# EAGLE design shiftregisterbuttons (EAGLE 9.6.2)
Assembly variants: CS HIGH, CS LOW
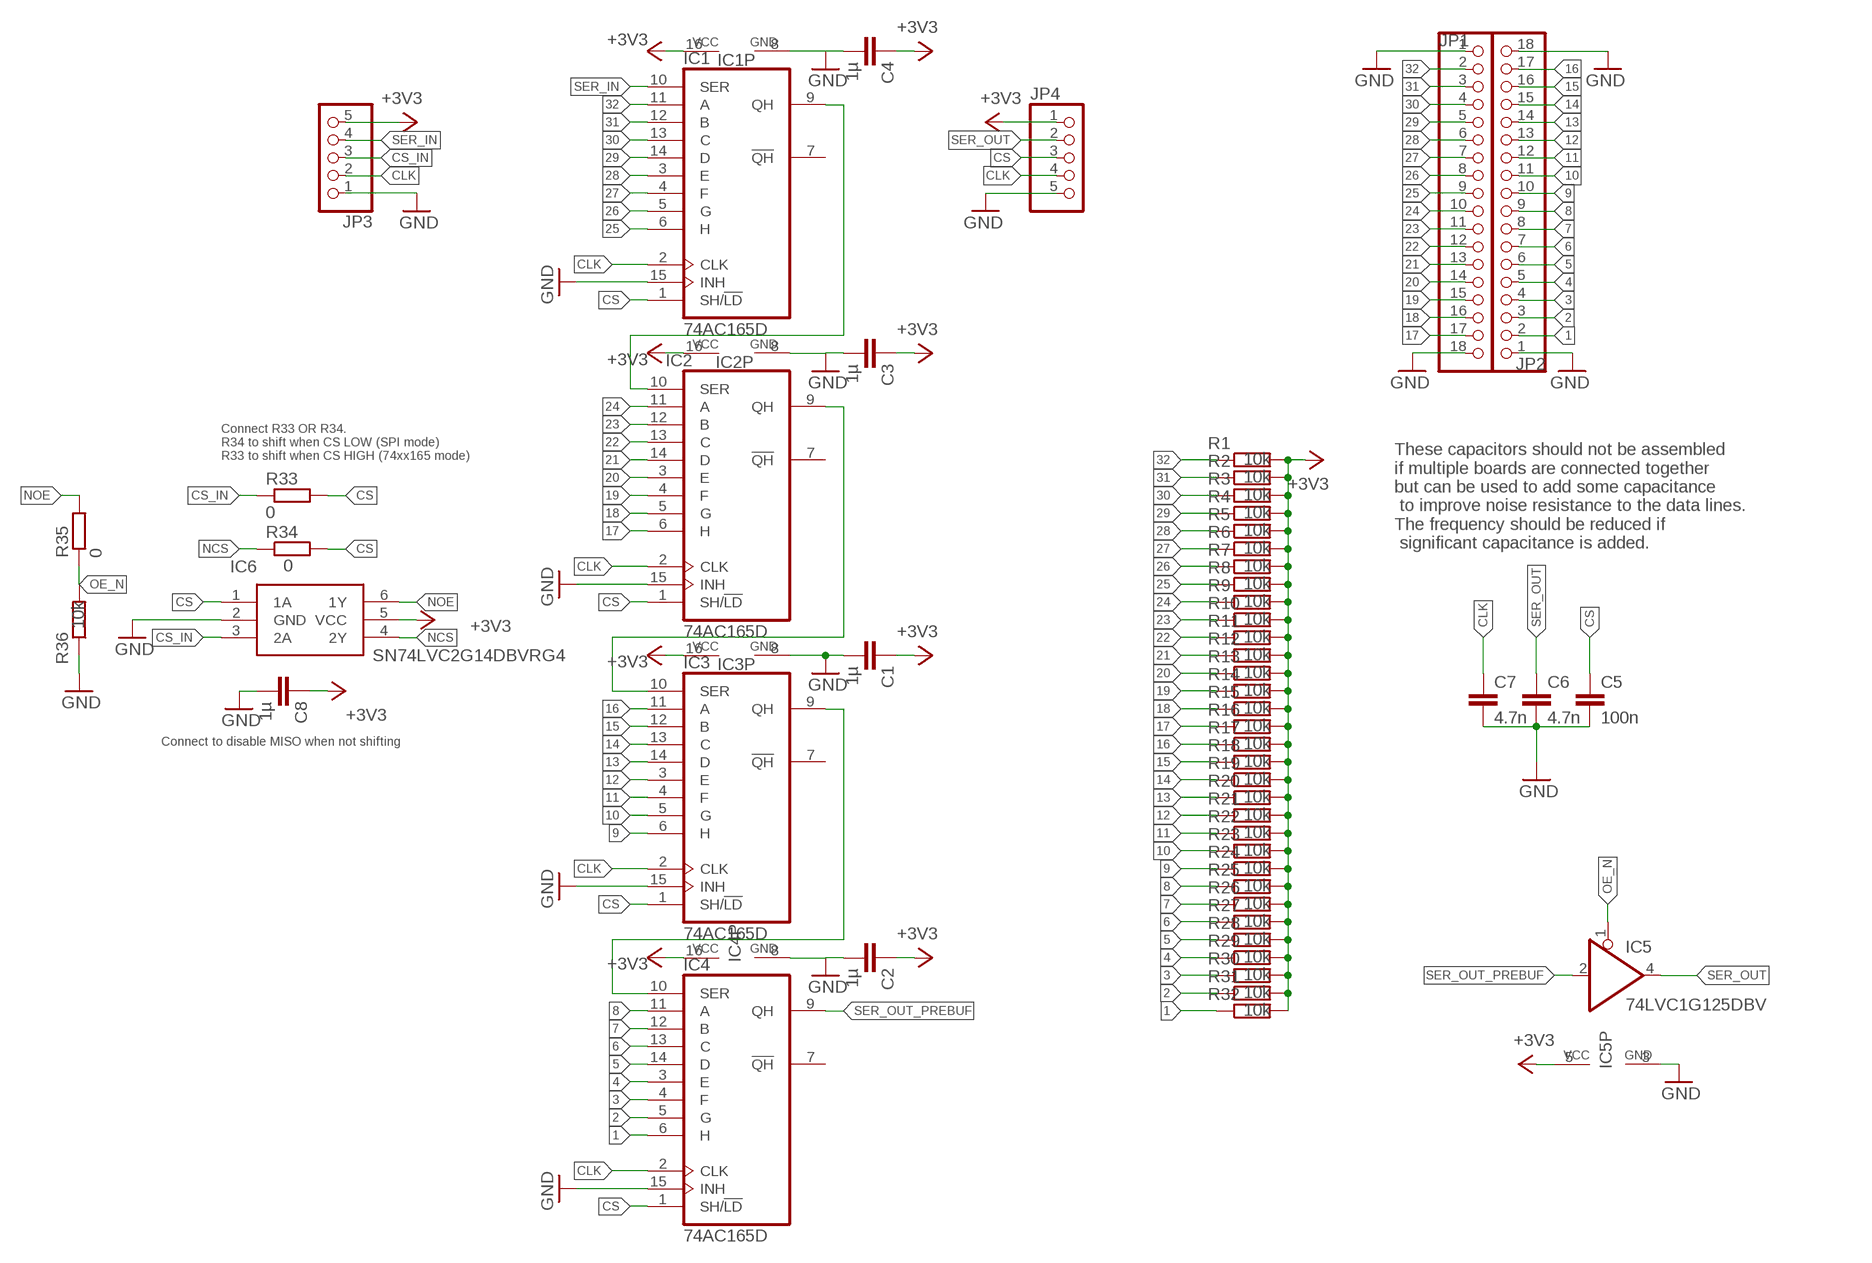
[diagram p0: schematic, sheet 1]

## Parts
C1  1µ  C-EUC0603  [C0603]
C2  1µ  C-EUC0603  [C0603]
C3  1µ  C-EUC0603  [C0603]
C4  1µ  C-EUC0603  [C0603]
C5  100n  C-EUC0603  [C0603]  (not fitted in variant CS HIGH)  (not fitted in variant CS LOW)
C6  4.7n  C-EUC0603  [C0603]  (not fitted in variant CS HIGH)  (not fitted in variant CS LOW)
C7  4.7n  C-EUC0603  [C0603]  (not fitted in variant CS HIGH)  (not fitted in variant CS LOW)
C8  1µ  C-EUC0603  [C0603]
IC1  74AC165D  [SO16]
IC2  74AC165D  [SO16]
IC3  74AC165D  [SO16]
IC4  74AC165D  [SO16]
IC5  74LVC1G125DBV  [SOT23-5]
IC6  SN74LVC2G14DBVRG4  [SOT95P280X145-6N]
JP1  PINHD-1X18  [1X18]
JP2  PINHD-1X18  [1X18]
JP3  PINHD-1X5  [1X05]
JP4  PINHD-1X5  [1X05]
R1  10k  R-EU_R0603  [R0603]
R2  10k  R-EU_R0603  [R0603]
R3  10k  R-EU_R0603  [R0603]
R4  10k  R-EU_R0603  [R0603]
R5  10k  R-EU_R0603  [R0603]
R6  10k  R-EU_R0603  [R0603]
R7  10k  R-EU_R0603  [R0603]
R8  10k  R-EU_R0603  [R0603]
R9  10k  R-EU_R0603  [R0603]
R10  10k  R-EU_R0603  [R0603]
R11  10k  R-EU_R0603  [R0603]
R12  10k  R-EU_R0603  [R0603]
R13  10k  R-EU_R0603  [R0603]
R14  10k  R-EU_R0603  [R0603]
R15  10k  R-EU_R0603  [R0603]
R16  10k  R-EU_R0603  [R0603]
R17  10k  R-EU_R0603  [R0603]
R18  10k  R-EU_R0603  [R0603]
R19  10k  R-EU_R0603  [R0603]
R20  10k  R-EU_R0603  [R0603]
R21  10k  R-EU_R0603  [R0603]
R22  10k  R-EU_R0603  [R0603]
R23  10k  R-EU_R0603  [R0603]
R24  10k  R-EU_R0603  [R0603]
R25  10k  R-EU_R0603  [R0603]
R26  10k  R-EU_R0603  [R0603]
R27  10k  R-EU_R0603  [R0603]
R28  10k  R-EU_R0603  [R0603]
R29  10k  R-EU_R0603  [R0603]
R30  10k  R-EU_R0603  [R0603]
R31  10k  R-EU_R0603  [R0603]
R32  10k  R-EU_R0603  [R0603]
R33  0  R-EU_R0603  [R0603]  (not fitted in variant CS LOW)
R34  0  R-EU_R0603  [R0603]  (not fitted in variant CS HIGH)
R35  0  R-EU_R0603  [R0603]
R36  10k  R-EU_R0603  [R0603]

## Nets
1: IC4.6(H) JP2.2 R32.1
2: IC4.5(G) JP2.3 R31.1
3: IC4.4(F) JP2.4 R30.1
4: IC4.3(E) JP2.5 R29.1
5: IC4.14(D) JP2.6 R28.1
6: IC4.13(C) JP2.7 R27.1
7: IC4.12(B) JP2.8 R26.1
8: IC4.11(A) JP2.9 R25.1
9: IC3.6(H) JP2.10 R24.1
10: IC3.5(G) JP2.11 R23.1
11: IC3.4(F) JP2.12 R22.1
12: IC3.3(E) JP2.13 R21.1
13: IC3.14(D) JP2.14 R20.1
14: IC3.13(C) JP2.15 R19.1
15: IC3.12(B) JP2.16 R18.1
16: IC3.11(A) JP2.17 R17.1
17: IC2.6(H) JP1.17 R16.1
18: IC2.5(G) JP1.16 R15.1
19: IC2.4(F) JP1.15 R14.1
20: IC2.3(E) JP1.14 R13.1
21: IC2.14(D) JP1.13 R12.1
22: IC2.13(C) JP1.12 R11.1
23: IC2.12(B) JP1.11 R10.1
24: IC2.11(A) JP1.10 R9.1
25: IC1.6(H) JP1.9 R8.1
26: IC1.5(G) JP1.8 R7.1
27: IC1.4(F) JP1.7 R6.1
28: IC1.3(E) JP1.6 R5.1
29: IC1.14(D) JP1.5 R4.1
30: IC1.13(C) JP1.4 R3.1
31: IC1.12(B) JP1.3 R2.1
32: IC1.11(A) JP1.2 R1.1
+3V3: C1.1 C2.1 C3.1 C4.1 C8.1 IC1.16(VCC) IC2.16(VCC) IC3.16(VCC) IC4.16(VCC) IC5.5(VCC) IC6.5(VCC) JP3.5 JP4.1 R1.2 R2.2 R3.2 R4.2 R5.2 R6.2 R7.2 R8.2 R9.2 R10.2 R11.2 R12.2 R13.2 R14.2 R15.2 R16.2 R17.2 R18.2 R19.2 R20.2 R21.2 R22.2 R23.2 R24.2 R25.2 R26.2 R27.2 R28.2 R29.2 R30.2 R31.2 R32.2
CLK: C7.1 IC1.2(CLK) IC2.2(CLK) IC3.2(CLK) IC4.2(CLK) JP3.2 JP4.4
CS: C5.1 IC1.1(SH/!LD) IC2.1(SH/!LD) IC3.1(SH/!LD) IC4.1(SH/!LD) IC6.1(1A) JP4.3 R33.2 R34.2
CS_IN: IC6.3(2A) JP3.3 R33.1
GND: C1.2 C2.2 C3.2 C4.2 C5.2 C6.2 C7.2 C8.2 IC1.8(GND) IC1.15(INH) IC2.8(GND) IC2.15(INH) IC3.8(GND) IC3.15(INH) IC4.8(GND) IC4.15(INH) IC5.3(GND) IC6.2(GND) JP1.1 JP1.18 JP2.1 JP2.18 JP3.1 JP4.5 R36.1
N$1: IC2.9(QH) IC3.10(SER)
N$2: IC3.9(QH) IC4.10(SER)
NCS: IC6.4(2Y) R34.1
NOE: IC6.6(1Y) R35.2
OE_N: IC5.1(OE) R35.1 R36.2
SER1: IC1.9(QH) IC2.10(SER)
SER_IN: IC1.10(SER) JP3.4
SER_OUT: C6.1 IC5.4(O) JP4.2
SER_OUT_PREBUF: IC4.9(QH) IC5.2(I)
Unconnected: IC1.7(!QH) IC2.7(!QH) IC3.7(!QH) IC4.7(!QH)

## Notes on the sheet
- Connect R33 OR R34.
  R34 to shift when CS LOW (SPI mode)
  R33 to shift when CS HIGH (74xx165 mode)
- These capacitors should not be assembled 
  if multiple boards are connected together 
  but can be used to add some capacitance
   to improve noise resistance to the data lines.
  The frequency should be reduced if
   significant capacitance is added.
- Connect to disable MISO when not shifting

## Library data of the parts
C1-C8 = resistor:C-EU: CAPACITOR, European symbol
IC1-IC4 = 74xx-eu:74*165: 8-bit parallel load SHIFT REGISTER
IC5 = 74xx-little-de:74*1G125: Single Bus Buffer Gate with 3-State Output
IC6 = SamacSys_Parts:SN74LVC2G14DBVRG4: Dual Schmitt-Trigger Inverter Source: Datasheet <http://www.ti.com/lit/gpn/SN74LVC2G14>; ARROW_PART_NUMBER: SN74LVC2G14DBVRG4; ARROW_PRICE-STOCK: https://www.arrow.com/en/products/sn74lvc2g14dbvrg4/texas-instruments?utm_currency=USD&region=nac; DESCRIPTION: Dual Schmitt-Trigger Inverter; HEIGHT: 1.45mm; MANUFACTURER_NAME: Texas Instruments; MANUFACTURER_PART_NUMBER: SN74LVC2G14DBVRG4; MOUSER_PART_NUMBER: 595-SN74LVC2G14DBVG4; MOUSER_PRICE-STOCK: https://www.mouser.co.uk/ProductDetail/Texas-Instruments/SN74LVC2G14DBVRG4?qs=pajgIaoyDUjLahZkznp%2F9Q%3D%3D
JP1 JP2 = pinhead:PINHD-1X18: PIN HEADER
JP3 JP4 = pinhead:PINHD-1X5: PIN HEADER
R1-R36 = resistor:R-EU_: RESISTOR, European symbol

## Board
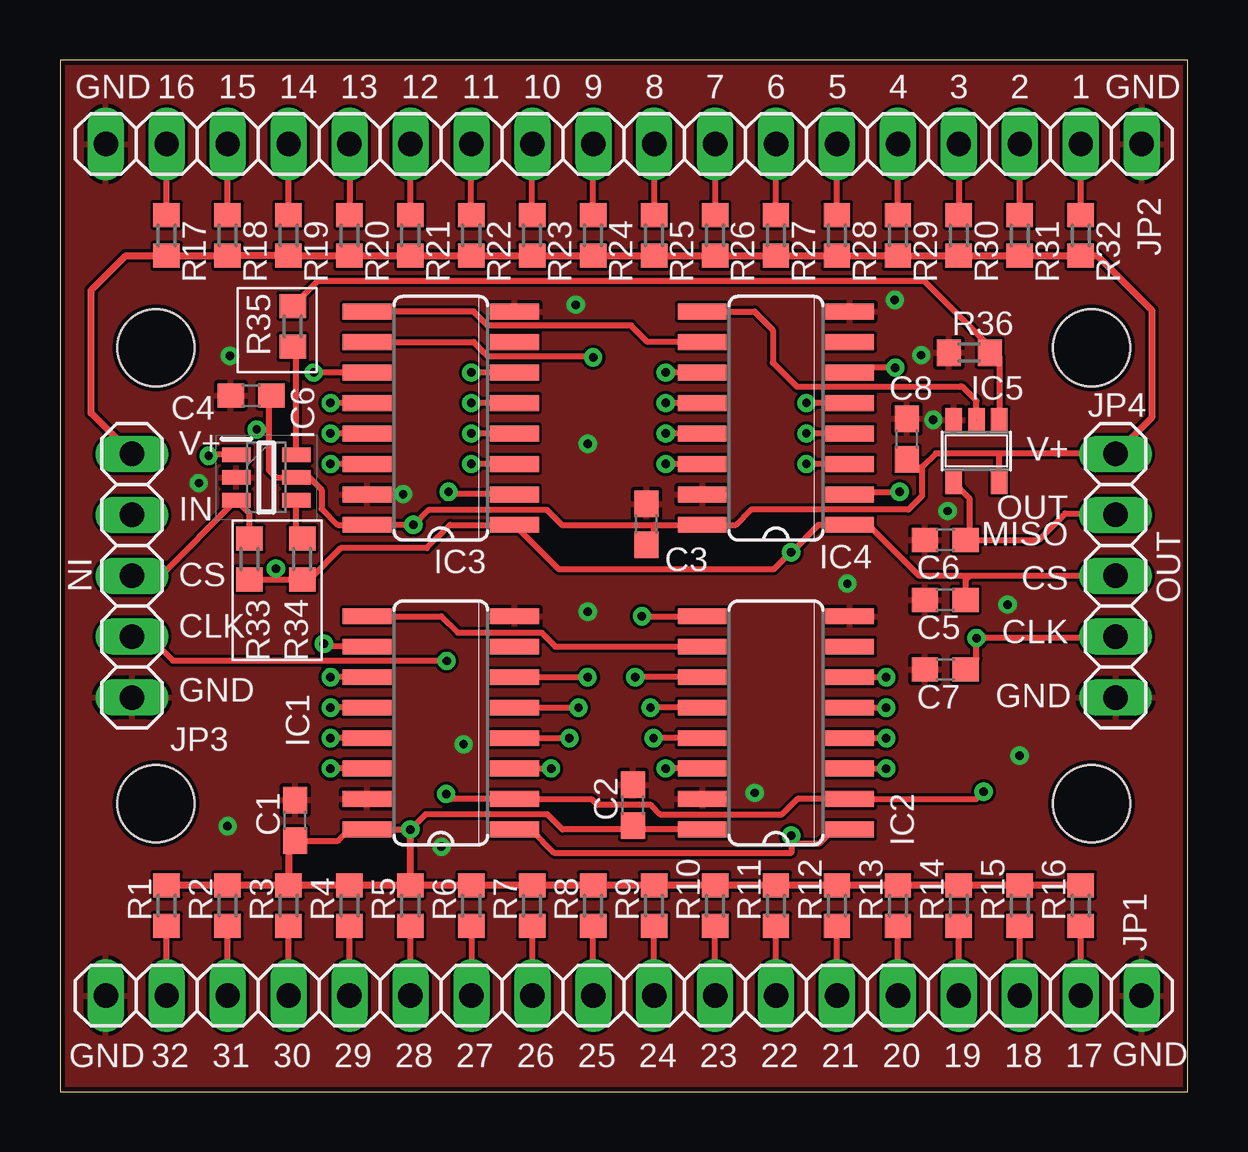
[diagram p1: board, top side]
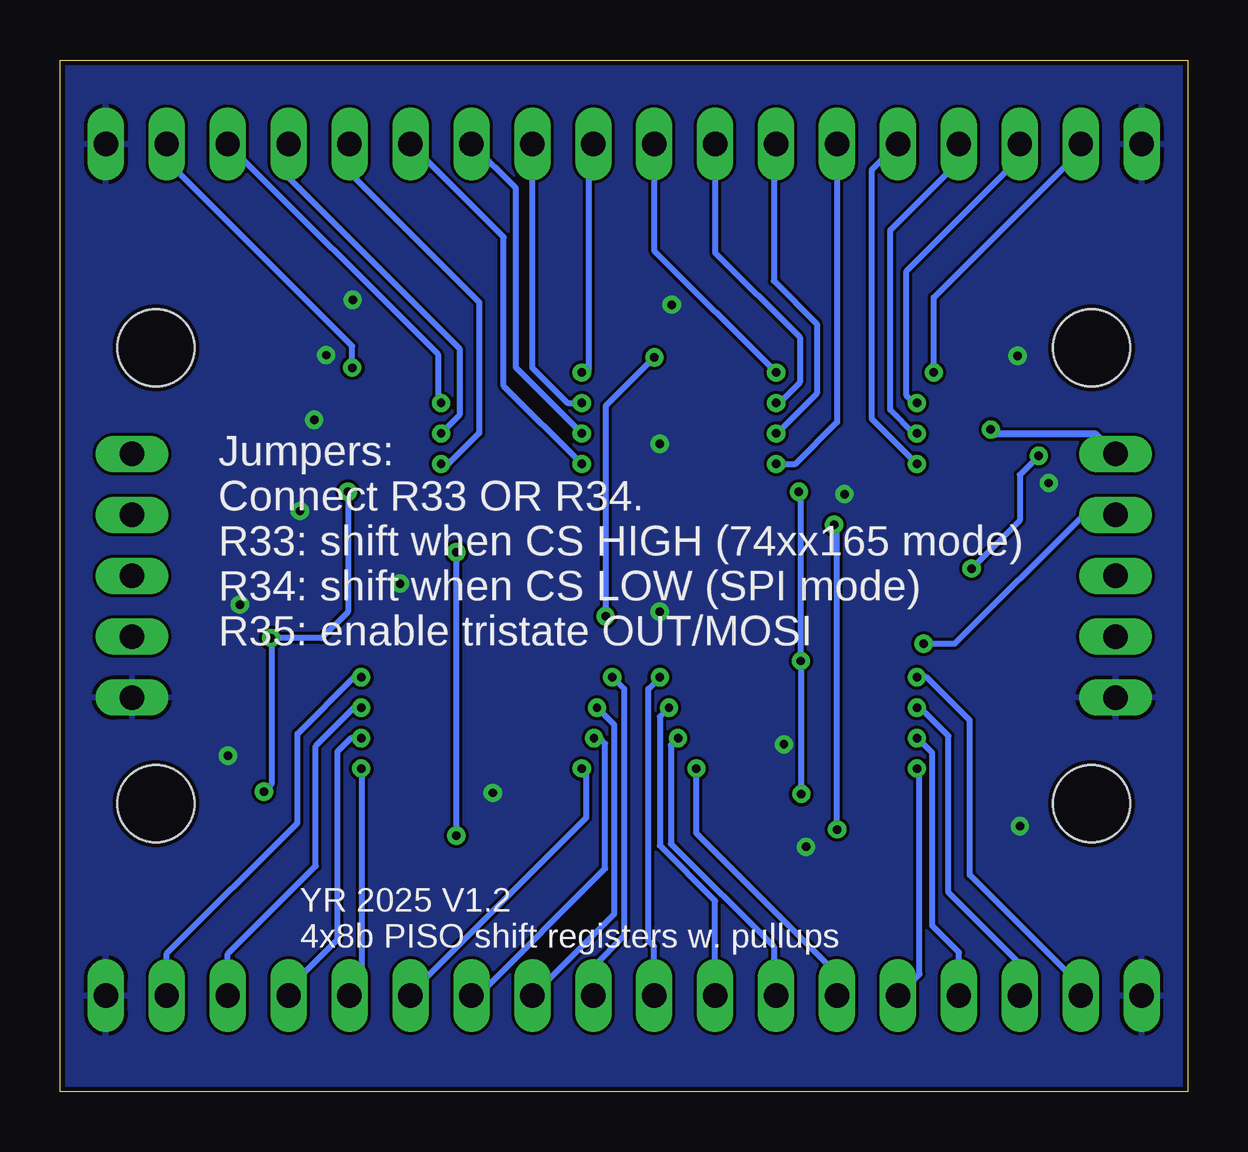
[diagram p2: board, bottom side, seen from below]

Size 47 x 43 mm. Coordinates in mm from the lower left corner, seen from the top.
Outline: 0,43 0,0 47,0 47,43 0,43
Copper layers (1*16): Top 0.035mm / dielectric 1.5mm / Bottom 0.035mm
Design rules "jlcpcb *": minimum track width 5mil, minimum drill 0.3mm, track to track 5mil, track to pad 5mil, pad to pad 5mil, via to via 5mil, smd to smd 5mil, copper to edge 0.2mm, drill to drill 8mil, minimum pad ring 10mil, minimum via ring 8mil, stop-mask expansion 4mil, vias tented up to drill 4mm, thermal gap 6mil
Holes 3.2 mm at 4,31 4,12 43,12 43,31

### Footprints (pad centres in the part's own frame; a part is rotated, then mirrored left to right if it is on the bottom)
C0603 = smd 1.1 x 1: 1 -0.85,0; 2 0.85,0
SO16 = smd 0.66 x 2.032: 1 -4.445,-3.073; 2 -3.175,-3.073; 3 -1.905,-3.073; 4 -0.635,-3.073; 5 0.635,-3.073; 6 1.905,-3.073; 7 3.175,-3.073; 8 4.445,-3.073; 9 4.445,3.073; 10 3.175,3.073; 11 1.905,3.073; 12 0.635,3.073; 13 -0.635,3.073; 14 -1.905,3.073; 15 -3.175,3.073; 16 -4.445,3.073
SOT23-5 = smd 0.69 x 0.99: 1 -0.95,-1.29; 2 0,-1.29; 3 0.95,-1.29; 4 0.95,1.3; 5 -0.95,1.3
SOT95P280X145-6N = smd 1.2 x 0.6: 1 -1.25,0.95; 2 -1.25,0; 3 -1.25,-0.95; 4 1.25,-0.95; 5 1.25,0; 6 1.25,0.95
1X18 = drill 1.016 long: 1 -21.59,0; 2 -19.05,0; 3 -16.51,0; 4 -13.97,0; 5 -11.43,0; 6 -8.89,0; 7 -6.35,0; 8 -3.81,0; 9 -1.27,0; 10 1.27,0; 11 3.81,0; 12 6.35,0; 13 8.89,0; 14 11.43,0; 15 13.97,0; 16 16.51,0; 17 19.05,0; 18 21.59,0
1X05 = drill 1.016 long: 1 -5.08,0; 2 -2.54,0; 3 0,0; 4 2.54,0; 5 5.08,0
R0603 = smd 1 x 1.1: 1 -0.85,0; 2 0.85,0

### Placement (x,y rotation side)
C1  9.79,11.3 90 top
C2  23.88,11.94 90 top
C3  24.44,23.65 90 top
C4  7.97,29.01 180 top
C5  36.9,20.5 180 top  (not fitted)
C6  36.9,23 180 top  (not fitted)
C7  36.9,17.6 180 top  (not fitted)
C8  35.3,27.2 90 top
IC1  15.88,15.37 90 top
IC2  29.84,15.37 90 top
IC3  15.88,28.07 90 top
IC4  29.84,28.07 90 top
IC5  38.2,26.7 180 top
IC6  8.6,25.6 0 top
JP1  23.5,4 0 top
JP2  23.5,39.5 180 top
JP3  3,21.5 90 top
JP4  44,21.5 270 top
R1  4.45,7.75 90 top
R2  6.99,7.75 90 top
R3  9.53,7.75 90 top
R4  12.06,7.75 90 top
R5  14.61,7.75 90 top
R6  17.14,7.75 90 top
R7  19.68,7.75 90 top
R8  22.23,7.75 90 top
R9  24.77,7.75 90 top
R10  27.3,7.75 90 top
R11  29.84,7.75 90 top
R12  32.38,7.75 90 top
R13  34.92,7.75 90 top
R14  37.47,7.75 90 top
R15  40.01,7.75 90 top
R16  42.55,7.75 90 top
R17  4.45,35.69 270 top
R18  6.99,35.69 270 top
R19  9.53,35.69 270 top
R20  12.06,35.69 270 top
R21  14.61,35.69 270 top
R22  17.14,35.69 270 top
R23  19.68,35.69 270 top
R24  22.23,35.69 270 top
R25  24.77,35.69 270 top
R26  27.3,35.69 270 top
R27  29.84,35.69 270 top
R28  32.38,35.69 270 top
R29  34.92,35.69 270 top
R30  37.47,35.69 270 top
R31  40.01,35.69 270 top
R32  42.55,35.69 270 top
R33  7.9,22.2 270 top
R34  10.1,22.2 270 top  (not fitted)
R35  9.7,31.9 270 top
R36  37.9,30.8 0 top

### Tracks (layer width: path | path; a pad name or v marks a point on that pad's centre or on a via)
1  (via drill 0.35)
  Top 0.254: IC4.6 33.12,30.17 v34.82,30.17 | R32.1 42.37,36.72 42.55,36.9 JP2.2
  Bottom 0.254: v34.82,30.17 34.82,31.07 42.55,38.8 JP2.2
2  (via drill 0.35)
  Top 0.254: IC4.5 v31.11,28.7 | R31.1 40.09,36.62 40.01,36.7 JP2.3
  Bottom 0.254: JP2.3 31.24,30.73 31.24,28.83 v31.11,28.7
3  (via drill 0.35)
  Top 0.254: IC4.4 v31.11,27.43 | JP2.4 R30.1
  Bottom 0.254: JP2.4 37.47,38.1 30.34,30.98 30.34,28.2 v31.11,27.43
4  (via drill 0.35)
  Top 0.254: IC4.3 v31.11,26.16 | R29.1 34.9,36.57 34.93,36.6 JP2.5
  Bottom 0.254: JP2.5 34.93,38.3 29.53,32.9 29.53,27.45 30.82,26.16 v31.11,26.16
5  (via drill 0.35)
  Top 0.254: IC4.14 v25.25,26.16 | R28.1 32.38,36.41 32.39,36.4 JP2.6
  Bottom 0.254: v25.25,26.16 28.5,29.42 28.5,35.61 JP2.6
6  (via drill 0.35)
  Top 0.254: IC4.13 v25.25,27.43 | R27.1 29.84,39.34 29.93,39.42 JP2.7
  Bottom 0.254: v25.25,27.43 27.99,30.18 27.99,37.65 JP2.7 | JP2.7
7  (via drill 0.35)
  Top 0.254: IC4.12 v25.25,28.7 | JP2.8 27.31,36.9 27.13,36.72 R26.1
  Bottom 0.254: JP2.8 27.31,30.16 25.85,28.7 v25.25,28.7
8  (via drill 0.35)
  Top 0.254: IC4.11 v25.25,29.97 | JP2.9 24.77,36.8 24.64,36.67 R25.1
  Bottom 0.254: JP2.9 24.97,39.3 24.97,29.97 v25.25,29.97
9  (via drill 0.35)
  Top 0.254: IC3.6 v17.14,29.97 | R24.1 JP2.10
  Bottom 0.254: JP2.10 22.23,35.06 v17.14,29.97
10  (via drill 0.35)
  Top 0.254: JP2.11 19.64,39.45 19.68,39.4 R23.1 | IC3.5 v17.14,28.7
  Bottom 0.254: JP2.11 19.69,34.97 16.16,31.44 16.16,29.56 17.01,28.7 v17.14,28.7
11  (via drill 0.35)
  Top 0.254: IC3.4 v17.14,27.43 | R22.1 JP2.12
  Bottom 0.254: JP2.12 17.25,39.4 17.25,33.8 15.45,32 15.45,29.1 17.12,27.43 v17.14,27.43
12  (via drill 0.35)
  Top 0.254: IC3.3 v17.14,26.16 | R21.1 JP2.13
  Bottom 0.254: v17.14,26.16 16.34,26.16 14.61,27.9 JP2.13
13  (via drill 0.35)
  Top 0.254: IC3.14 v11.28,26.16 | JP2.14 R20.1
  Bottom 0.254: v11.28,26.16 13.17,28.06 13.17,38.4 JP2.14
14  (via drill 0.35)
  Top 0.254: IC3.13 v11.28,27.43 | R19.1 JP2.15
  Bottom 0.254: v11.28,27.43 11.4,27.43 12.39,28.42 12.39,35.9 9.53,38.76 JP2.15
15  (via drill 0.35)
  Top 0.254: JP2.16 | IC3.12 v11.28,28.7 | R18.1 JP2.16
  Bottom 0.254: v11.28,28.7 11.4,28.7 11.71,29.01 11.71,34.2 7.09,38.82 7.09,39.5 JP2.16
16  (via drill 0.35)
  Top 0.254: JP2.17 R17.1 | IC3.11 v10.58,29.97
  Bottom 0.254: v10.58,29.97 10.58,33.1 4.45,39.23 JP2.17
17  (via drill 0.35)
  Top 0.254: IC2.6 v34.44,17.27 | JP1.17 R16.1
  Bottom 0.254: JP1.17 42.55,5.75 37.1,11.2 37.1,14.91 34.74,17.27 v34.44,17.27
18  (via drill 0.35)
  Top 0.254: IC2.5 v34.44,16 | JP1.16 R15.1
  Bottom 0.254: JP1.16 40.01,5.73 36.34,9.4 36.34,14.4 34.74,16 v34.44,16
19  (via drill 0.35)
  Top 0.254: IC2.4 v34.44,14.73 | JP1.15 R14.1
  Bottom 0.254: v34.44,14.73 34.87,14.73 35.43,14.17 35.43,6.34 37.47,4.3 JP1.15
20  (via drill 0.35)
  Top 0.254: IC2.3 v34.44,13.46 | JP1.14 R13.1
  Bottom 0.254: JP1.14 34.42,4 34.42,13.44 v34.44,13.46
21  (via drill 0.35)
  Top 0.254: IC2.14 v25.25,13.46 | JP1.13 R12.1
  Bottom 0.254: v25.25,13.46 25.07,13.28 25.07,11.41 32.39,4.09 JP1.13
22  (via drill 0.35)
  Top 0.254: IC2.13 v24.74,14.73 | JP1.12 R11.1
  Bottom 0.254: JP1.12 29.58,4 24.28,9.3 24.28,14.5 24.51,14.73 v24.74,14.73
23  (via drill 0.35)
  Top 0.254: IC2.12 v24.61,16 | JP1.11 R10.1
  Bottom 0.254: v24.61,16 23.89,15.28 23.89,7.42 JP1.11
24  (via drill 0.35)
  Top 0.254: IC2.11 v23.98,17.27 | JP1.10 R9.1
  Bottom 0.254: JP1.10 24.77,5.2 23.49,6.48 23.49,16.78 v23.98,17.27
25  (via drill 0.35)
  Top 0.254: IC1.6 v22,17.27 | JP1.9 R8.1
  Bottom 0.254: v22,17.27 22.48,16.79 22.48,6.29 22.23,6.04 JP1.9
26  (via drill 0.35)
  Top 0.254: IC1.5 v21.61,16 | JP1.8 R7.1
  Bottom 0.254: JP1.8 19.69,7.95 21.99,10.25 21.99,15.62 v21.61,16
27  (via drill 0.35)
  Top 0.254: IC1.4 v21.23,14.73 | JP1.7 R6.1
  Bottom 0.254: JP1.7 17.25,4.1 17.25,6.05 21.53,10.33 21.53,14.44 v21.23,14.73
28  (via drill 0.35)
  Top 0.254: IC1.3 v20.47,13.46 | JP1.6 R5.1
  Bottom 0.254: JP1.6 14.61,4.9 20.47,10.76 v20.47,13.46
29  (via drill 0.35)
  Top 0.254: IC1.14 v11.28,13.46 | JP1.5 R4.1
  Bottom 0.254: v11.28,13.46 11.18,13.36 11.18,4.89 JP1.5
30  (via drill 0.35)
  Top 0.254: IC1.13 v11.28,14.73 | JP1.4 R3.1
  Bottom 0.254: v11.28,14.73 11.25,14.73 10.64,14.12 10.64,6.92 9.53,5.8 JP1.4
31  (via drill 0.35)
  Top 0.254: IC1.12 v11.28,16 | JP1.3 R2.1
  Bottom 0.254: v11.28,16 11.15,16 9.96,14.81 9.96,8.3 6.99,5.33 JP1.3
32  (via drill 0.35)
  Top 0.254: IC1.11 v11.28,17.27 | JP1.2 R1.1
  Bottom 0.254: v11.28,17.27 10.88,17.27 9.08,15.47 9.08,9.03 4.45,4.4 JP1.2
+3V3  (via drill 0.35)
  Top 0.254: IC2.16 23.71,10.92 | 23.71,10.92 20.95,10.92 20.32,11.56 15.24,11.56 v14.61,10.92 IC1.16 12.76,10.96 12.1,10.96 11.6,10.45 C1.1 | 24.77,23.62 20.92,23.62 20.29,24.26 15.37,24.26 v14.73,23.62 IC3.16 11.58,23.62 10.9,24.3 10.9,25.1 10.4,25.6 IC6.5 9,25.6 8.7,25.9 8.7,27.6 | 24.77,23.62 IC4.16 28.17,23.62 28.8,24.26 35.36,24.26 35.93,24.83 35.93,26.03 | C3.1 24.77,23.13 24.77,23.62 | C2.1 23.71,10.92 | JP4.1 43.98,26.6 39.2,26.6 | 39.2,26.6 36.5,26.6 35.93,26.03 | IC5.5 39.15,26.55 39.2,26.6 | 8.7,27.6 8.7,28.89 C4.1 8.6,29.23 | v8.2,27.6 8.7,27.6 | C8.1 35.62,26.03 35.93,26.03
  Top 0.3: JP4.1 45.5,28.08 45.5,32.58 43.24,34.84 R32.2 R31.2 R30.2 R29.2 R28.2 R27.2 R26.2 R25.2 R24.2 R23.2 R22.2 R21.2 R20.2 R19.2 R18.2 R17.2 2.74,34.84 1.3,33.4 1.3,28.28 JP3.5 | R16.2 R15.2 R14.2 R13.2 R12.2 R11.2 R10.2 R9.2 R8.2 R7.2 R6.2 R5.2 | R5.2 v14.61,10.92 | R5.2 R4.2 R3.2 | C1.1 9.53,10.18 R3.2 | R3.2 R2.2 R1.2
  Bottom 0.254: v14.61,10.92 14.61,23.5 v14.73,23.62
  Bottom 0.3: JP3.5 3.82,27.4 8,27.4 v8.2,27.6
CLK  (via drill 0.35)
  Top 0.254: 43,18.96 JP4.4 43.94,18.9 v38.2,18.9 38.2,18.05 C7.1 | JP3.2 3.71,18.96 4.71,17.96 16.11,17.96 v16.12,17.95 | v16.2,25 16.3,24.9 IC3.2 | IC4.2 33.03,25 v35,25 | v16.1,12.4 16.31,12.19 IC1.2 22.15,12.19 22.4,11.94 24.64,11.94 25.02,11.56 30.1,11.56 30.73,12.19 IC2.2 38.19,12.19 v38.5,12.5
  Bottom 0.254: v16.2,25 16.12,24.92 v16.12,17.95 16.1,17.93 v16.1,12.4 | v35,25 35,20 36.1,18.9 v38.2,18.9 38.18,18.88 38.18,12.82 v38.5,12.5
CS  (via drill 0.35)
  Top 0.254: JP4.3 37.9,21.5 | 37.9,21.5 35.83,21.5 33.7,23.62 IC4.1 31.62,23.62 v30.48,22.48 30.46,22.48 29.75,21.77 20.8,21.77 IC3.1 16.26,23.62 15.29,22.65 11.7,22.65 10.4,21.35 R34.2 9,21.35 | IC1.1 19.63,10.92 20.6,9.96 30.48,9.96 30.48,10.34 | 30.48,10.34 31.65,10.34 32.23,10.92 IC2.1 | v30.48,10.67 30.48,10.34 | C5.1 37.75,21.35 37.9,21.5 | R33.2 9,21.35 | IC6.1 6.25,26.55 v6.2,26.5 | v9,21.8 9,21.35
  Bottom 0.254: v30.48,22.48 v30.48,10.67 | v6.2,26.5 7,25.7 7,23.8 v9,21.8
CS_IN
  Top 0.254: JP3.3 4.2,21.5 IC6.3 7.9,24.1 R33.1
GND  (via drill 0.35)
  Top 0.254: C2.2 23.91,12.82 | IC3.15 v14.29,24.89 v14.3,24.9
  other vias: 22,27 22,20 39.5,20.3 37,24.2 36.4,28 40,14 28.96,12.45 16.82,14.47 6.99,11.06 5.79,25.36 7.08,30.66 15.9,10.2 21.5,32.8 34.8,33 35.9,30.7 32.82,21.17
  pour Bottom: 0,43.18 0,-0.27 47,-0.27 47,43.18
  pour Top: 0,43.18 0,-0.27 47,-0.27 47,43.18
N$1  (via drill 0.35)
  Top 0.254: IC3.10 17.24,31.24 17.83,30.66 22.17,30.66 v22.23,30.61 | v24.26,19.81 IC2.9
  Bottom 0.254: v22.23,30.61 24.26,28.57 v24.26,19.81
N$2
  Top 0.254: IC4.10 24.49,31.24 23.8,31.93 17.83,31.93 17.24,32.51 IC3.9
NCS
  Top 0.254: R34.1 9.85,23.3 IC6.4
NOE
  Top 0.254: IC6.6 9.85,30.9 R35.2
OE_N
  Top 0.254: R35.1 10.75,33.8 36,33.8 38.9,30.9 | 38.9,30.9 39.15,30.65 IC5.1 | R36.2 38.85,30.9 38.9,30.9
SER1
  Top 0.254: IC1.9 15.9,19.81 16.59,19.13 20.07,19.13 20.65,18.54 IC2.10
SER_IN  (via drill 0.35)
  Top 0.254: IC1.10 11.13,18.54 v11,18.67
  Bottom 0.254: v11,18.67 9.7,18.67 4.33,24.04 JP3.4
SER_OUT
  Top 0.254: IC5.4 37.9,24.75 37.9,23.15 C6.1 40.8,23 41.9,24.1 43.94,24.1 JP4.2
SER_OUT_PREBUF
  Top 0.254: IC4.9 28.96,32.51 29.72,31.75 29.72,30.38 30.72,29.38 37.5,29.38 37.62,29.38 38.2,28.8 IC5.2

### Text on the board
tPlace: GND | 16 | 15 | 14 | 13 | 12 | 11 | 10 | 9 | 8 | 7 | 6 | 5 | 4 | 3 | 2 | 1 | GND | V+ | V+ | OUT | IN | MISO | OUT | IN | CS | CS | CLK | CLK | GND | GND | GND | 32 | 31 | 30 | 29 | 28 | 27 | 26 | 25 | 24 | 23 | 22 | 21 | 20 | 19 | 18 | 17 | GND
bPlace: Jumpers: / Connect R33 OR R34. / R33: shift when CS HIGH (74xx165 mode) / R34: shift when CS LOW (SPI mode) / R35: enable tristate OUT/MOSI | YR 2025 V1.2 / 4x8b PISO shift registers w. pullups